# EAGLE board osbo_v11 (EAGLE 7.2.0)
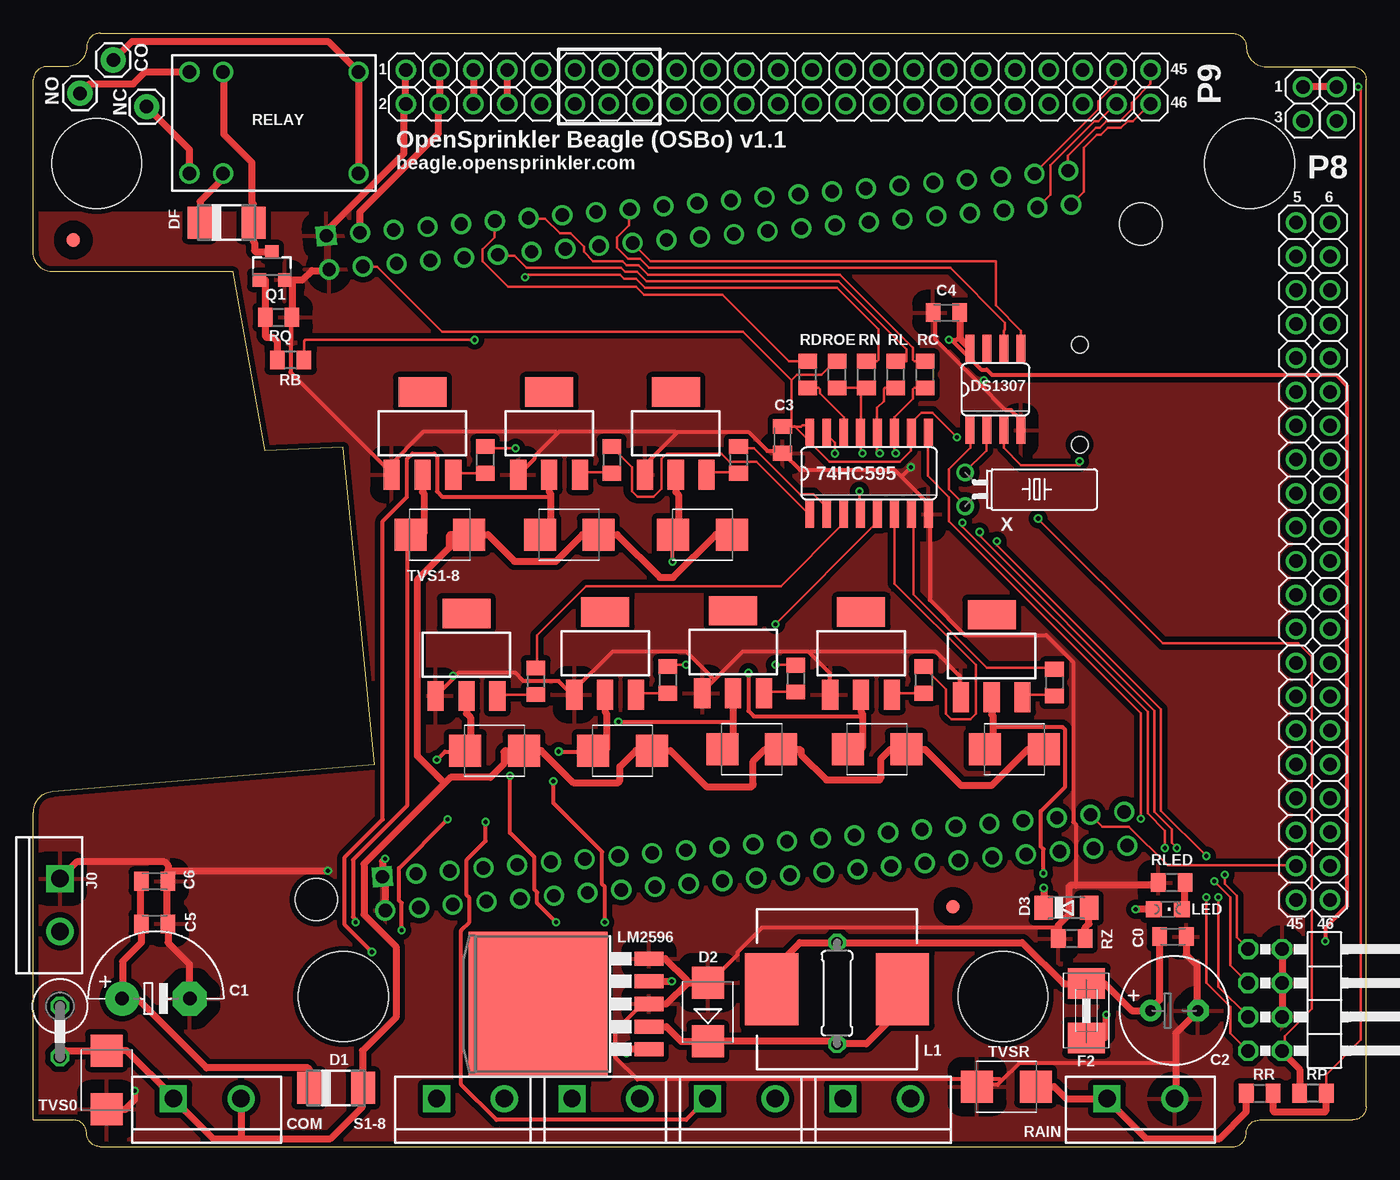
[diagram p1: board, top side]
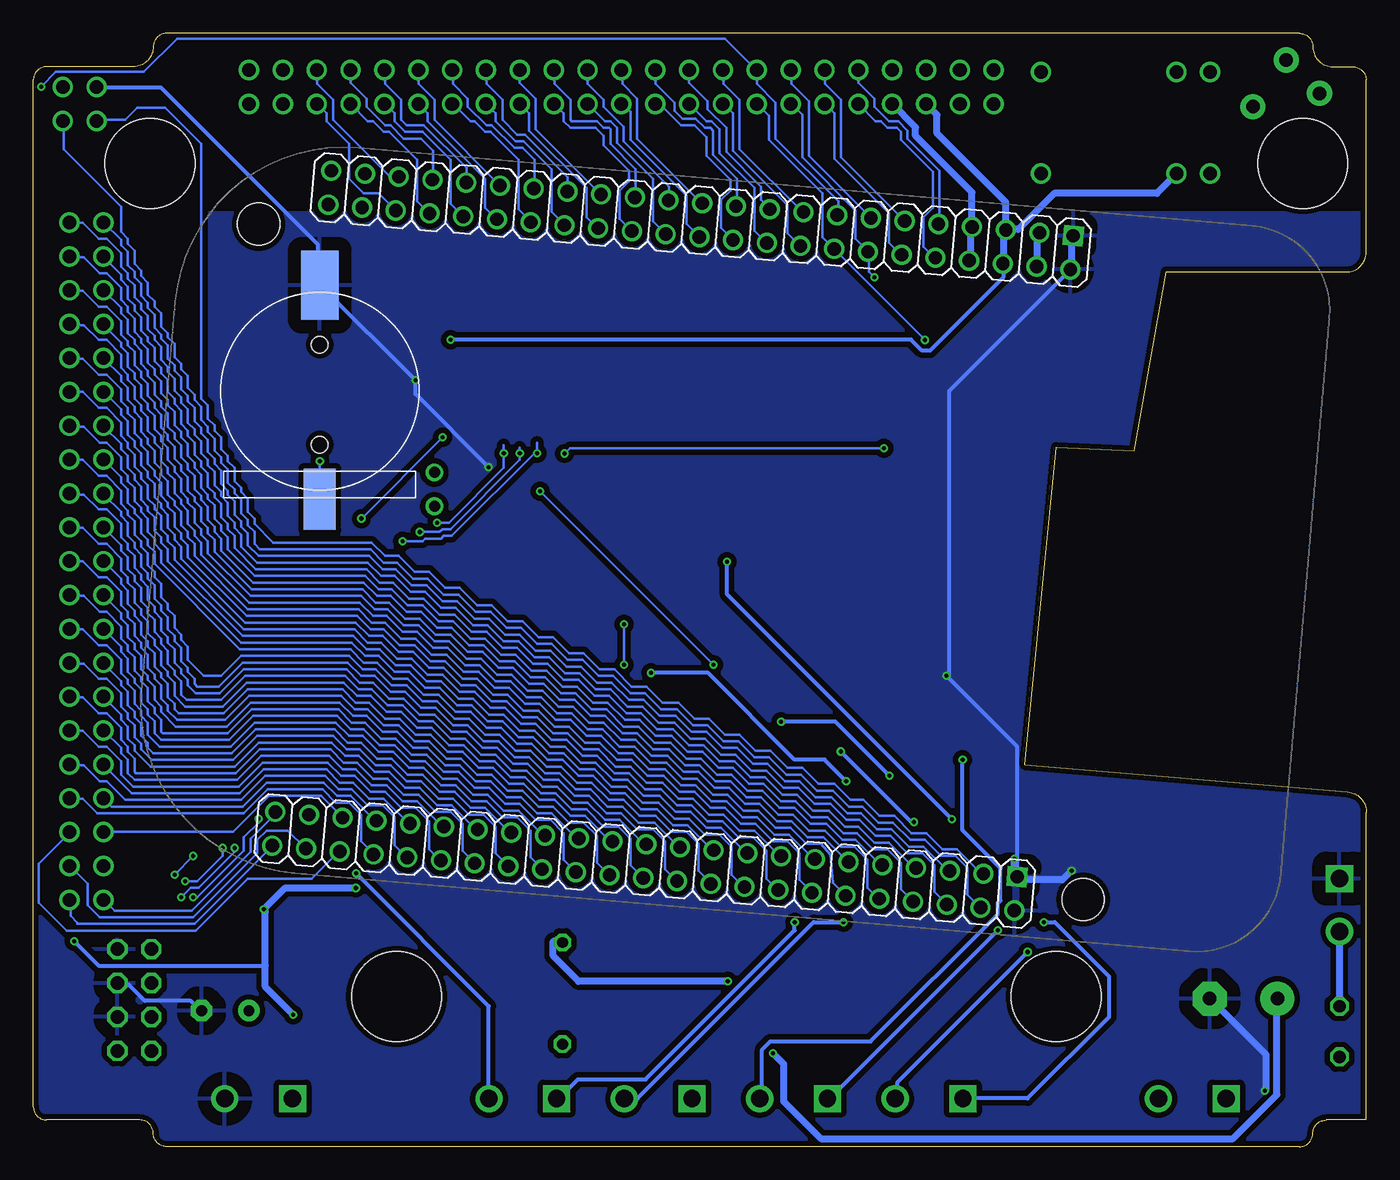
[diagram p2: board, bottom side, seen from below]

Size 100 x 83.5 mm. Coordinates in mm from the lower left corner, seen from the top.
Outline: 5,0 90,0 arc90 91,1 arc-90 92,2 99,2 arc90 100,3 100,80 arc90 99,81 92.5,81 arc-90 91,82.5 arc90 90,83.5 5,83.5 arc90 4,82.5 arc-90 2.5,81 1,81 arc90 0,80 0,67.05 arc90 1.5,65.6 15,65.6 17.4,52.2 23.25,52.45 25.6,28.65 1.4,26.6 arc90 0,25.05 0,2 3,2 arc-90 4,1 arc90 5,0
Copper layers (1*16): Top 0.035mm / dielectric 1.5mm / Bottom 0.035mm
Design rules "Fusion_eagle_rule_v1.1 *": minimum track width 6mil, minimum drill 12mil, track to track 6mil, track to pad 6mil, pad to pad 6mil, via to via 6mil, smd to smd 0mil, copper to edge 10mil, drill to drill 10mil, minimum pad ring 10mil, minimum via ring 6mil, stop-mask expansion 2mil, vias tented up to drill 100mil, thermal gap 40mil
Net classes: 0 default: width 0.203 mm, clearance 0.203 mm; 1 power: width 0.305 mm, clearance 0.254 mm; 2 relay power: width 0.406 mm, clearance 0.254 mm
Holes 6.75 mm at 4.76,73.74 91.24,73.74 23.26,11.26 72.74,11.26

## Footprints (pad centres in the part's own frame; a part is rotated, then mirrored left to right if it is on the bottom)
SO16 = smd 0.66 x 2.032: 1 -4.445,-3.073; 2 -3.175,-3.073; 3 -1.905,-3.073; 4 -0.635,-3.073; 5 0.635,-3.073; 6 1.905,-3.073; 7 3.175,-3.073; 8 4.445,-3.073; 9 4.445,3.073; 10 3.175,3.073; 11 1.905,3.073; 12 0.635,3.073; 13 -0.635,3.073; 14 -1.905,3.073; 15 -3.175,3.073; 16 -4.445,3.073
BATTCON_12MM_SMT = smd 2.8 x 5.2: P$1 0,11.96 | smd 2.4 x 4.6: P$2 0,-4.1 | hole 1.25: 0,7.5; 0,0
C0805K = smd 1.1 x 1.4: 1 -1,0; 2 1,0
E5-10.5-1 = drill 1.016 pad 2.54: + -2.54,0 | drill 1.016 pad 2.54 octagon: - 2.54,0
E3,5-8 = drill 0.813 pad 1.6: + -1.778,0 | drill 0.813 pad 1.6 octagon: - 1.778,0
SCREWTERMINAL-5MM-2-X = drill 1.3 pad 2.032 square: 1 0,0 | drill 1.3 pad 2.032: 2 5.08,0
DO-214AC = smd 1.8 x 2.4: A 2.025,0; C -2.025,0
SMB = smd 2.4 x 2.4: A 2.2,0; C -2.2,0
MINIMELF = smd 1.4 x 1.8: A 1.7,0; C -1.7,0
SO08 = smd 0.66 x 2.032: 1 -1.905,-3.073; 2 -0.635,-3.073; 3 0.635,-3.073; 4 1.905,-3.073; 5 1.905,3.073; 6 0.635,3.073; 7 -0.635,3.073; 8 -1.905,3.073
2X04/90 = drill 1.016 octagon: 1 -3.81,-6.35; 2 -3.81,-3.81; 3 -1.27,-6.35; 4 -1.27,-3.81; 5 1.27,-6.35; 6 1.27,-3.81; 7 3.81,-6.35; 8 3.81,-3.81
0411V = drill 0.914 octagon: 1 -2.54,0; 2 1.27,0
1812 = smd 2.286 x 2.794: 1 -2.046,0; 2 2.046,0
SCREWTERMINAL-4MM-2-X = drill 1.3 pad 2.032 square: 1 0,0 | drill 1.3 pad 2.032: 2 3.96,0
1X01 = drill 1.016 pad 1.88: 1 0,0
CDRH125 = smd 5.4 x 4: 1 0,4.9; 2 0,-4.9
0207/7 = drill 0.813 octagon: 1 -3.81,0; 2 3.81,0
CHIPLED_0805 = smd 1.2 x 1.2: A 0,-1.05; C 0,1.05
TO263-5 = smd 1.067 x 2.159: 1 -3.404,-5.791; 2 -1.702,-5.791; 3 0,-5.791; 4 1.702,-5.791; 5 3.404,-5.791 | smd 10.8 x 10.41: 6 0,2.54
1X02 = drill 1.016: 1 -1.27,0; 2 1.27,0
1X21 = drill 1.016: 1 -25.4,0; 2 -22.86,0; 3 -20.32,0; 4 -17.78,0; 5 -15.24,0; 6 -12.7,0; 7 -10.16,0; 8 -7.62,0; 9 -5.08,0; 10 -2.54,0; 11 0,0; 12 2.54,0; 13 5.08,0; 14 7.62,0; 15 10.16,0; 16 12.7,0; 17 15.24,0; 18 17.78,0; 19 20.32,0; 20 22.86,0; 21 25.4,0
1X23 = drill 1.016: 1 -27.94,0; 2 -25.4,0; 3 -22.86,0; 4 -20.32,0; 5 -17.78,0; 6 -15.24,0; 7 -12.7,0; 8 -10.16,0; 9 -7.62,0; 10 -5.08,0; 11 -2.54,0; 12 0,0; 13 2.54,0; 14 5.08,0; 15 7.62,0; 16 10.16,0; 17 12.7,0; 18 15.24,0; 19 17.78,0; 20 20.32,0; 21 22.86,0; 22 25.4,0; 23 27.94,0
SOT23-3 = smd 1 x 1: 1 -0.95,-1; 2 0.95,-1; 3 0,1.1
R0805 = smd 1.1 x 1.4: 1 -1,0; 2 1,0
RELAY-HK4100F = drill 1.016: 1 12.7,7.62; 2 10.16,7.62; 5 0,7.62; 6 0,0; 9 10.16,0; 10 12.7,0
SOT223 = smd 1.219 x 2.235: 1 -2.311,-3.099; 2 0,-3.099; 3 2.311,-3.099 | smd 3.6 x 2.2: 4 0,3.099
FIDUCIAL_1MM = smd 1 x 1: 1 0,0
BEAGLEBONE_SHIELD = drill 1 square: 1 19.685,50.165; 47 19.685,1.905 | drill 1: 2 19.685,52.705; 3 22.225,50.165; 4 22.225,52.705; 5 24.765,50.165; 6 24.765,52.705; 7 27.305,50.165; 8 27.305,52.705; 9 29.845,50.165; 10 29.845,52.705; 11 32.385,50.165; 12 32.385,52.705; 13 34.925,50.165; 14 34.925,52.705; 15 37.465,50.165; 16 37.465,52.705; 17 40.005,50.165; 18 40.005,52.705; 19 42.545,50.165; 20 42.545,52.705; 21 45.085,50.165; 22 45.085,52.705; 23 47.625,50.165; 24 47.625,52.705; 25 50.165,50.165; 26 50.165,52.705; 27 52.705,50.165; 28 52.705,52.705; 29 55.245,50.165; 30 55.245,52.705; 31 57.785,50.165; 32 57.785,52.705; 33 60.325,50.165; 34 60.325,52.705; 35 62.865,50.165; 36 62.865,52.705; 37 65.405,50.165; 38 65.405,52.705; 39 67.945,50.165; 40 67.945,52.705; 41 70.485,50.165; 42 70.485,52.705; 43 73.025,50.165; 44 73.025,52.705; 45 75.565,50.165; 46 75.565,52.705; 48 19.685,4.445; 49 22.225,1.905; 50 22.225,4.445; 51 24.765,1.905; 52 24.765,4.445; 53 27.305,1.905; 54 27.305,4.445; 55 29.845,1.905; 56 29.845,4.445; 57 32.385,1.905; 58 32.385,4.445; 59 34.925,1.905; 60 34.925,4.445; 61 37.465,1.905; 62 37.465,4.445; 63 40.005,1.905; 64 40.005,4.445; 65 42.545,1.905; 66 42.545,4.445; 67 45.085,1.905; 68 45.085,4.445; 69 47.625,1.905; 70 47.625,4.445; 71 50.165,1.905; 72 50.165,4.445; 73 52.705,1.905; 74 52.705,4.445; 75 55.245,1.905; 76 55.245,4.445; 77 57.785,1.905; 78 57.785,4.445; 79 60.325,1.905; 80 60.325,4.445; 81 62.865,1.905; 82 62.865,4.445; 83 65.405,1.905; 84 65.405,4.445; 85 67.945,1.905; 86 67.945,4.445; 87 70.485,1.905; 88 70.485,4.445; 89 73.025,1.905; 90 73.025,4.445; 91 75.565,1.905; 92 75.565,4.445 | hole 3.175: 14.605,51.435; 80.645,6.35
TC38H = drill 0.813: 1 -1.27,0; 2 1.27,0

## Placement (x,y rotation side)
74HC595  74HC595N  [SO16]  62.7,50.5 0 top
BAT  [BATTCON_12MM_SMT]  78.5,52.65 0 bottom
C0  0.1u  [C0805K]  85.5,15.75 0 top
C1  220uF/63V  [E5-10.5-1]  9.2,11.1 0 top
C2  100u  [E3,5-8]  85.6,10.2 0 top
C3  0.1u  [C0805K]  56.2,53 270 top
C4  0.1u  [C0805K]  68.5,62.55 180 top
C5  0.01u  [C0805K]  9.1,16.7 0 top
C6  0.1u  [C0805K]  9.1,19.9 0 top
COM  [SCREWTERMINAL-5MM-2-X]  10.5,3.6 0 top
D1  S1B  [DO-214AC]  22.7,4.4 0 top
D2  SS24  [SMB]  50.6,10.1 90 top
D3  5.6V  [MINIMELF]  77.5,17.9 0 top
DF  S1B  [DO-214AC]  14.5,69.3 0 top
DS1307  DS1307  [SO08]  72.18,56.8 0 top
EXTOUT1  [2X04/90]  97.5,11 270 top
F1  2A  [0411V]  2,8 270 top
F2  [1812]  79,10.2 270 top
J0  24VAC IN  [SCREWTERMINAL-4MM-2-X]  2,20.1 270 top
JCO  M01PTH  [1X01]  6,81.5 0 top
JNC  M01PTH  [1X01]  8.5,78 180 top
JNO  M01PTH  [1X01]  3.5,79 0 top
L1  150uH  [CDRH125]  60.3,11.8 270 top
L1'  150uH  [0207/7]  60.3,11.5 90 top
LED  [CHIPLED_0805]  85.1,17.8 270 top
LM2596  LM2596-5.0  [TO263-5]  40.4,10.7 90 top
P8-11  [1X02]  95.25,78.2 270 top
P8-12  PINHD-1X21  [1X21]  94.74,43.91 270 top
P8-21  [1X02]  97.79,78.2 270 top
P8-22  PINHD-1X21  [1X21]  97.28,43.91 270 top
P9-1  PINHD-1X23  [1X23]  55.88,80.74 0 top
P9-2  PINHD-1X23  [1X23]  55.88,78.2 0 top
Q1  2N7002  [SOT23-3]  17.9,66 0 top
R1  220  [R0805]  33.9,51.5 270 top
R2  220  [R0805]  43.4,51.5 270 top
R3  220\  [R0805]  52.9,51.5 270 top
R4  220  [R0805]  37.7,34.9 270 top
R5  220  [R0805]  47.6,35 270 top
R6  220  [R0805]  57.2,35.1 270 top
R7  220  [R0805]  66.8,35 270 top
R8  220  [R0805]  76.6,34.8 270 top
RAIN  [SCREWTERMINAL-5MM-2-X]  80.55,3.6 0 top
RB  1.5K  [R0805]  19.3,59 180 top
RC  47  [R0805]  66.9,57.9 90 top
RD  47  [R0805]  58.1,57.9 90 top
RELAY  HK4100-5V  [RELAY-HK4100F]  24.4,80.6 180 top
RL  47  [R0805]  64.7,57.9 90 top
RLED  1K  [R0805]  85.4,19.8 180 top
RN  47  [R0805]  62.5,57.9 90 top
ROE  10K  [R0805]  60.3,57.9 90 top
RP  30K  [R0805]  96,4 180 top
RQ  100K  [R0805]  18.4,62.2 0 top
RR  4.7K  [R0805]  92,4 0 top
RZ  10  [R0805]  77.9,15.6 180 top
S12  [SCREWTERMINAL-5MM-2-X]  30.26,3.6 0 top
S34  [SCREWTERMINAL-5MM-2-X]  40.42,3.6 0 top
S56  [SCREWTERMINAL-5MM-2-X]  50.58,3.6 0 top
S78  [SCREWTERMINAL-5MM-2-X]  60.74,3.6 0 top
T1  BT1308W  [SOT223]  29.2,53.5 0 top
T2  BT1308W  [SOT223]  38.7,53.5 0 top
T3  BT1308W  [SOT223]  48.2,53.5 0 top
T4  BT1308W  [SOT223]  32.5,36.9 0 top
T5  BT1308W  [SOT223]  42.9,37 0 top
T6  BT1308W  [SOT223]  52.5,37.1 0 top
T7  BT1308W  [SOT223]  62.1,37 0 top
T8  BT1308W  [SOT223]  71.9,36.8 0 top
TVS0  SMBJ48CA  [SMB]  5.5,5 270 top
TVS1  SMBJ48CA  [SMB]  30.5,45.9 180 top
TVS2  TVSSMB  [SMB]  40.2,45.9 180 top
TVS3  TVSSMB  [SMB]  50.2,45.9 180 top
TVS4  TVSSMB  [SMB]  34.6,29.7 180 top
TVS5  TVSSMB  [SMB]  44.2,29.7 180 top
TVS6  TVSSMB  [SMB]  53.9,29.8 180 top
TVS7  TVSSMB  [SMB]  63.3,29.8 180 top
TVS8  TVSSMB  [SMB]  73.6,29.8 180 top
TVSR  TVSSMB  [SMB]  73,4.5 180 top
U$1  FIDUCIAL  [FIDUCIAL_1MM]  3,68 0 top
U$2  BEAGLEBONE_OUTLINE  [BEAGLEBONE_SHIELD]  2.2,68.5 175 bottom
U$3  FIDUCIAL  [FIDUCIAL_1MM]  69,18 0 top
X  32.768kHz  [TC38H]  69.9,49.3 270 top

## Tracks (layer width: path | path; a pad name or v marks a point on that pad's centre or on a via)
24VAC
  Top 0.508: F1.2 2,6.8 2.4,7.2 TVS0.C 7,7.2 10.4,3.8 COM.1 13.5,0.6 15.6,0.6 | 15.6,0.6 22.3,0.6 24.7,3 24.7,4.4 D1.A 24.7,4.6 24.7,7.2 27.2,9.7 27.2,15 24.8,17.4 24.8,21.2 30.85,27.25 | 15.6,0.6 15.6,3.6 COM.2 | TVS8.C 74.6,29.8 71.9,27.1 69.6,27.1 66.9,29.8 TVS7.C 64.3,29.8 63.6,29.1 63.6,27.7 63.5,27.5 59.5,27.5 57.6,29.4 57.6,29.7 57.5,29.8 TVS6.C 54.9,29.8 54,28.9 54,27.2 53.9,27 50.5,27 47.8,29.7 TVS5.C 45.2,29.7 44,28.5 44,27.5 43.9,27.3 40.5,27.3 38.1,29.7 TVS4.C 35.4,29.7 35.3,29.6 35.3,28.7 34.3,27.7 31.3,27.7 30.85,27.25 | TVS3.C 51.2,45.9 48,42.7 47,42.7 43.8,45.9 TVS2.C 41.2,45.9 39.2,43.9 36.1,43.9 34.1,45.9 TVS1.C 31.3,45.9 31.2,45.8 31.2,44.9 28.8,42.5 28.8,29.3 30.85,27.25
  Bottom 0.508: 2,6.7 F1.2
A1  (via drill 0.3)
  Top 0.203: v36.9,65.2 37.1,65.4 44,65.4 44.3,65.1 45.2,65.1 45.9,64.4 60.3,64.4 63.4,61.3 63.4,59 63.3,58.9 RN.2
  Bottom 0.203: P9-2.7 43.1,78.2 42.3,77.4 42.3,74.2 38.3,70.2 38.3,68.1 37.4,67.2 U$2.60 37.3,67.1 37.3,65.6 v36.9,65.2
ACIN
  Bottom 0.508: J0.2 F1.1
CO
  Top 0.508: JCO.1 7.4,82.9 22.1,82.9 RELAY.6 RELAY.5
D5
  Top 0.203: RD.2 56.7,58.9 51.7,63.9 45.8,63.9 45.2,64.5 35.6,64.5 33.7,66.4 33.7,67.3 34.6,68.2 34.6,69.4 U$2.57
  Bottom 0.203: P9-1.6 40.6,80.7 40.6,79.7 39.4,78.5 39.4,74.2 34.7,69.5 U$2.57
D6
  Top 0.203: RC.2 66.1,58.9 66,59 66,59.9 60.5,65.4 46.1,65.4 45.4,66.1 44.5,66.1 44.2,66.4 42,66.4 41.3,67.1 41.3,67.5 40.3,68.5 39.5,68.5 38.4,69.6 37.2,69.6 U$2.59
  Bottom 0.203: P9-1.7 43.1,80.7 43.1,79.7 41.8,78.4 41.8,74.3 37.2,69.7 U$2.59
D7
  Top 0.203: RL.2 65.5,58.9 65.5,59.8 60.4,64.9 46,64.9 45.3,65.6 44.4,65.6 44.1,65.9 37,65.9 36.1,66.8 34.9,66.8 U$2.58
  Bottom 0.203: P9-2.6 40.6,78.2 39.9,77.5 39.9,74.1 35.8,70 35.8,67.8 34.9,66.9 U$2.58
GND  (via drill 0.3)
  Top 0.305: 58.22,37.05 58.12,37.15 53.24,37.15 51.11,35.02 | 58.22,37.05 59.74,35.53 59.74,33.9 T7.1 | 51.11,35.02 50.19,34.11 T6.1 | T8.1 69.49,33.9 69.49,35.33 67.67,37.15 58.32,37.15 58.22,37.05 | 31.6,35.22 31.9,35.53 36.17,35.53 36.78,34.92 39.42,34.92 40.44,33.9 T5.1 40.44,34.11 43.49,37.15 48.97,37.15 51.11,35.02 | 31.6,35.22 30.28,33.9 T4.1 | v31.5,35.33 31.6,35.22 | D2.A 50.8,12.36 52.83,14.39 52.83,14.6 54.66,16.43 76.81,16.43 76.9,16.6 | 72.64,4.95 73.97,6.27 85.7,6.27 | 72.64,4.95 72.34,4.64 70.92,4.64 TVSR.A | LM2596.3 46.13,10.53 45.52,10.53 43.69,8.71 43.69,6.67 45.31,5.05 72.54,5.05 72.64,4.95 | 71.02,57.17 72.95,55.24 73.36,55.24 73.97,54.63 73.97,53.82 DS1307.4 | 71.02,57.17 67.67,60.52 67.67,62.35 C4.2 | v71.32,57.47 71.02,57.17 | RQ.2 19.3,62.15 19.3,58.08 26.82,50.56 T1.1 26.62,50.97 29.26,53.61 39.22,53.61 39.32,53.51 | 48.26,53.51 45.92,51.17 45.92,50.56 T3.1 | 48.26,53.51 48.36,53.61 53.65,53.61 55.07,52.19 56.08,52.19 C3.2 56.29,51.99 57.51,50.77 64.62,50.77 65.13,50.26 | 65.13,50.26 67.06,48.33 67.06,47.52 74HC595.8 67.26,47.31 67.26,41.01 69.9,38.37 76,38.37 78.03,36.34 78.03,24.35 78.23,24.15 78.23,19.6 | 39.32,53.51 39.42,53.61 48.16,53.61 48.26,53.51 | 39.32,53.51 37.59,51.78 37.59,51.58 36.58,50.56 T2.1 | 65.13,50.26 v65.84,50.97
  Top 0.508: 19.4,65 RQ.2 | Q1.2 19.4,65 | 19.4,65 20.2,65 20.9,65.7 22.1,65.7 U$2.48 | P9-1.1 P9-2.1 27.8,78 27.8,74.5 22,68.7 22,68.4 U$2.47 | 49.1,12.3 D2.A | 49.1,12.3 47.5,10.7 LM2596.3 | 49.1,12.3 49,12.5 47.4,14.1 LM2596.5 | C0.2 86.5,14.4 87.3,13.6 87.3,10.2 C2.- 87.2,10 85.7,8.5 85.7,6.27 85.7,3.6 RAIN.2 | RZ.2 76.9,16.6 77.7,17.4 77.7,19.5 77.8,19.6 78.23,19.6 84.4,19.6 RLED.2 | U$2.2 26.4,17.8 26.4,20 26.2,20.2 U$2.1 26.2,20.5 26.2,21.4 v26.4,21.6 | P8-11.1 95.3,79.5 97.7,79.5 P8-21.1 | EXTOUT1.2 93.7,12.3 EXTOUT1.4 93.7,12 93.7,9.8 EXTOUT1.6 | C1.- 11.7,11.1 11.7,13.7 10.1,15.3 C5.2 10,17 10,20 C6.2 10.1,20.7 | 10.1,20.7 10.1,21.1 9.8,21.4 3.3,21.4 J0.1 | 10.1,20.7 v22.1,20.7 | v7.6,4.2 7.6,3.5 6.9,2.8 TVS0.A
  Bottom 0.305: U$2.1 26.21,20.29 26.21,30.04 v31.5,35.33 31.29,35.33 31.29,56.66 22.35,65.6 U$2.48 | EXTOUT1.4 93.68,12.16 92.86,12.16 91.64,10.94 88.19,10.94 87.58,10.33 C2.- | P8-11.1 95.1,79.42 90.42,79.42 78.64,67.63 78.64,64.79 BAT.P$1 78.44,64.59 v71.32,57.47 71.32,56.46 v65.84,50.97
  Bottom 0.508: U$2.48 22.1,65.8 22.1,68.2 22,68.3 U$2.47 | v26.4,21.6 26.4,20.2 26.2,20 22.8,20 v22.1,20.7 | v7.6,4.2 7.5,4.3 7.5,6.9 11.7,11.1 C1.-
  pour Top (isolate 0.406): 0,70 100,70 100,0 0,0
  pour Bottom (isolate 0.406): 0,70 100,70 100,0 0,0
N$1
  Top 0.508: RLED.1 86.4,17.8 LED.C
N$2  (via drill 0.3)
  Top 0.508: C6.1 8,20 8,17 C5.1 8.1,15.3 6.7,13.9 6.7,11.1 C1.+ 6.9,11 7.9,11 13,5.9 20.6,5.9 20.7,5.8 20.7,4.4 D1.C | v44.5,7 44.8,7.3 46.1,7.3 LM2596.1
  Bottom 0.508: v44.5,7 43.7,6.2 43.7,3.4 40.9,0.6 10,0.6 6.7,3.9 6.7,11.1 C1.+
N$3
  Top 0.203: R1.2 31.6,50.5 T1.3
N$4  (via drill 0.3)
  Top 0.203: v55.68,36.14 57.1,36.14 R6.1 | v55.68,39.19 63.2,46.7 63.2,47.31 74HC595.5
  Bottom 0.203: v55.68,39.19 v55.68,36.14
N$5
  Top 0.203: R7.1 66.85,35.93 68.48,34.31 68.48,32.48 68.89,32.07 70.31,32.07 70.71,32.48 70.71,36.14 64.62,42.23 64.62,47.31 74HC595.6
N$6
  Top 0.508: D3.A 79.2,16.7 78.9,16.4 RZ.1
N$7
  Top 0.203: R8.1 76.4,35.93 71.53,35.93 66.04,41.42 66.04,47.31 74HC595.7
N$8
  Top 0.508: LM2596.2 47.5,9 48.6,7.9 D2.C 60.2,7.9 L1'.1 62.5,7.7 65.2,10.4 L1.1
N$9
  Top 0.203: DS1307.1 70.3,53.7 70.3,52.4 68.7,50.8 68.7,49.3 69.9,48.1 X.2
N$10  (via drill 0.3)
  Top 0.203: v48.97,36.14 47.75,36.14 R5.1 | v61.98,49.14 61.98,47.52 74HC595.4
  Bottom 0.203: v61.98,49.14 v48.97,36.14
N$11
  Top 0.203: R4.1 37.8,35.93 37.8,38.37 41.45,42.03 56.08,42.03 60.76,46.7 60.76,47.31 74HC595.3
N$12
  Top 0.203: R3.1 53.04,52.39 54.05,52.39 57.51,48.94 58.52,48.94 59.33,48.13 59.33,47.52 74HC595.2
N$13
  Top 0.203: R2.1 43.49,52.39 44.91,50.97 44.91,49.14 45.31,48.74 46.53,48.74 47.14,49.35 47.14,51.58 47.55,51.99 51.61,51.99 52.22,51.38 54.25,51.38 58.12,47.52 74HC595.1
N$14  (via drill 0.3)
  Top 0.203: v36.17,52.39 33.93,52.39 R1.1 | v60.15,51.99 60.15,52.8 59.54,53.41 74HC595.15
  Bottom 0.203: v36.17,52.39 59.74,52.39 v60.15,51.99
N$15
  Top 0.203: R2.2 43.28,50.56 41.05,50.56 T2.3
N$16  (via drill 0.3)
  Top 0.305: v24.18,16.83 24.18,17.04 23.98,17.24 23.98,21.51 28.04,25.57 28.04,45.48 28.25,45.69 TVS1.A
  Top 0.508: TVS1.A 29.2,45.9 29.3,46 29.3,49 29.2,49.1 T1.2
  Bottom 0.305: v24.18,16.83 23.37,16.83 19.3,12.77 19.3,9.72 25.4,3.63 30.07,3.63 S12.1
N$17  (via drill 0.3)
  Top 0.305: 38.8,48.74 30.68,48.74 30.28,49.14 30.28,51.78 30.07,51.99 28.45,51.99 28.04,51.58 28.04,48.74 26.21,46.91 26.21,24.55 23.37,21.71 23.37,16.63 v25.4,14.6
  Top 0.508: TVS2.A 38.8,45.9 38.8,48.74 38.8,49 38.7,49.1 T2.2
  Bottom 0.305: v25.4,14.6 35.15,4.85 35.15,3.63 S12.2
N$18  (via drill 0.3)
  Top 0.305: v47.96,43.86 47.96,45.69 TVS3.A | v31.09,24.55 27.43,20.9 27.43,18.46 27.64,18.26 v27.64,16.22
  Top 0.508: TVS3.A 48.4,45.9 48.4,48.9 48.2,49.1 T3.2
  Bottom 0.305: v47.96,43.86 47.96,41.42 v31.09,24.55 | v27.64,16.22 40.23,3.63 S34.1
N$19
  Top 0.203: R3.2 52.83,50.56 50.6,50.56 T3.3
N$20  (via drill 0.3)
  Top 0.305: v30.28,29.03 30.89,29.64 32.31,29.64 TVS4.A
  Top 0.508: TVS4.A 32.8,29.7 32.8,32.2 32.5,32.5 T4.2
  Bottom 0.305: v30.28,29.03 30.28,23.74 27.43,20.9 27.43,18.46 27.64,18.26 27.64,17.44 37.19,7.89 44.7,7.89 45.31,7.28 45.31,3.63 S34.2
N$21
  Top 0.203: R4.2 34.9,33.9 T4.3
N$22  (via drill 0.3)
  Top 0.305: v39.42,29.64 41.86,29.64 TVS5.A | v33.93,24.35 33.93,22.93 32.51,21.51 32.51,18.87 32.72,18.66 32.72,16.83 32.11,16.22 32.11,4.64 34.75,2 48.97,2 50.39,3.42 S56.1
  Top 0.508: TVS5.A 42.9,29.7 43,29.8 43,32.5 42.9,32.6 T5.2
  Bottom 0.305: v39.42,29.64 34.14,24.35 v33.93,24.35
N$23  (via drill 0.3)
  Top 0.305: v43.89,31.87 52.5,31.87 | v35.76,27.81 35.76,23.54 37.59,21.71 37.59,19.27 37.8,19.07 37.8,18.26 v39.22,16.83
  Top 0.508: TVS6.A 52.5,29.8 52.5,31.87 T6.2
  Bottom 0.305: v43.89,31.87 39.83,31.87 v35.76,27.81 | v39.22,16.83 41.45,16.83 54.66,3.63 55.47,3.63 S56.2
N$24  (via drill 0.3)
  Top 0.305: 62.2,32.28 54.05,32.28 53.65,32.68 v53.65,35.53 | v39.01,27.4 39.01,25.77 42.67,22.12 42.67,19.68 42.88,19.48 v42.88,16.83
  Top 0.508: TVS7.A 62.1,29.8 62.2,29.9 62.2,32.28 62.2,32.5 62.1,32.6 T7.2
  Bottom 0.305: v53.65,35.53 49.38,35.53 42.88,29.03 40.64,29.03 v39.01,27.4 | v42.88,16.83 42.88,16.22 54.05,5.05 59.13,5.05 60.55,3.63 S78.1
N$25  (via drill 0.3)
  Top 0.305: 72,31.46 77.22,31.46 77.42,31.26 77.42,26.99 75.59,25.16 75.59,22.52 75.79,22.32 v75.79,20.49
  Top 0.508: TVS8.A 72,29.8 72,31.46 72,32.3 71.9,32.4 T8.2
  Bottom 0.305: v75.79,20.49 65.84,10.53 65.84,3.63 S78.2
N$26
  Top 0.203: R5.2 45.3,34 T5.3
N$27
  Top 0.203: R6.2 54.9,34.1 T6.3
N$28
  Top 0.203: R7.2 64.5,34 T7.3
N$29
  Top 0.203: R8.2 76.4,33.9 74.37,33.9 T8.3
N$30
  Top 0.203: DS1307.2 71.5,53.7 71.5,52.2 69.9,50.6 X.1
N$31
  Top 0.508: TVSR.C 76.6,4.5 77.5,3.6 RAIN.1 80.7,3.4 83.5,0.6 89,0.6 91,2.6 RR.1
N$32
  Top 0.508: Q1.1 17.4,65 RQ.1 17.4,60.8 17.5,60.7 18,60.7 18.3,60.4 RB.2
N$34
  Bottom 0.203: U$2.3 28.8,20.4 30.7,22.3 31.8,22.3 33,23.5 34.1,23.5 35.4,24.8 36.5,24.8 37.7,26 38.7,26 39.9,27.2 41.1,27.2 42.3,28.4 43.4,28.4 44.7,29.7 45.8,29.7 47,30.9 48.1,30.9 49.3,32.1 50.4,32.1 51.6,33.3 52.8,33.3 54,34.5 55.1,34.5 56.4,35.8 57.5,35.8 58.7,37 59.8,37 61,38.2 62.1,38.2 63.3,39.4 64.4,39.4 65.6,40.6 66.7,40.6 68,41.9 69.1,41.9 70.3,43.1 71.4,43.1 72.6,44.3 73.6,44.3 74.6,45.3 82,45.3 83.4,46.7 83.4,47.1 83.9,47.6 83.9,48.6 84.4,49.1 84.4,49.4 84.9,49.9 84.9,50.9 85.4,51.4 85.4,51.8 85.9,52.3 85.9,53.2 86.4,53.7 86.4,54.1 86.9,54.6 86.9,55.6 87.4,56.1 87.4,75.2 90.1,77.9 92.2,77.9 93.1,77 95.2,77 P8-11.2
N$35
  Bottom 0.203: P8-12.1 94.7,69.3 93.4,68 93.4,67.6 92.9,67.1 92.9,66.1 92.4,65.6 92.4,65.2 91.9,64.7 91.9,63.8 91.4,63.3 91.4,62.9 90.9,62.4 90.9,61.4 90.4,60.9 90.4,60.6 89.9,60.1 89.9,59.1 89.4,58.6 89.4,58.2 88.9,57.7 88.9,56.8 88.4,56.3 88.4,55.9 87.9,55.4 87.9,54.4 87.4,53.9 87.4,53.5 86.9,53 86.9,52.1 86.4,51.6 86.4,51.2 85.9,50.7 85.9,49.7 85.4,49.2 85.4,48.9 84.9,48.4 84.9,47.4 84.4,46.9 84.4,46.5 83.9,46 83.9,45.1 83.1,44.3 74.8,44.3 73.8,43.3 72.8,43.3 71.6,42.1 70.5,42.1 69.3,40.9 68.2,40.9 66.9,39.6 65.8,39.6 64.6,38.4 63.5,38.4 62.3,37.2 61.2,37.2 60,36 58.9,36 57.7,34.8 56.6,34.8 55.3,33.5 54.2,33.5 53,32.3 51.8,32.3 50.6,31.1 49.5,31.1 48.3,29.9 47.2,29.9 46,28.7 44.9,28.7 43.6,27.4 42.5,27.4 41.3,26.2 40.1,26.2 38.9,25 37.9,25 36.7,23.8 35.6,23.8 34.3,22.5 33.2,22.5 31.3,20.6 U$2.5
N$36  (via drill 0.3)
  Top 0.203: DS1307.3 72.8,53.7 72.8,52.4 74.1,51.1 78.5,51.1 v78.5,51.4
  Bottom 0.203: v78.5,51.4 BAT.P$2
N$37
  Bottom 0.203: P8-12.2 94.7,66.7 93.4,65.4 93.4,65 92.9,64.5 92.9,63.6 92.4,63.1 92.4,62.7 91.9,62.2 91.9,61.2 91.4,60.7 91.4,60.4 90.9,59.9 90.9,58.9 90.4,58.4 90.4,58 89.9,57.5 89.9,56.6 89.4,56.1 89.4,55.7 88.9,55.2 88.9,54.2 88.4,53.7 88.4,53.3 87.9,52.8 87.9,51.9 87.4,51.4 87.4,51 86.9,50.5 86.9,49.5 86.4,49 86.4,48.7 85.9,48.2 85.9,47.2 85.4,46.7 85.4,46.3 84.9,45.8 84.9,44.9 83.3,43.3 75,43.3 74,42.3 73,42.3 71.8,41.1 70.7,41.1 69.5,39.9 68.4,39.9 67.1,38.6 66,38.6 64.8,37.4 63.7,37.4 62.5,36.2 61.4,36.2 60.2,35 59.1,35 57.9,33.8 56.8,33.8 55.5,32.5 54.4,32.5 53.2,31.3 52,31.3 50.8,30.1 49.7,30.1 48.5,28.9 47.4,28.9 46.2,27.7 45.1,27.7 43.8,26.4 42.7,26.4 41.5,25.2 40.3,25.2 39.1,24 38.1,24 36.9,22.8 35.8,22.8 34,21 33.8,21 U$2.7
N$38
  Bottom 0.203: P8-12.3 94.7,64.2 93.4,62.9 93.4,62.5 92.9,62 92.9,61 92.4,60.5 92.4,60.2 91.9,59.7 91.9,58.7 91.4,58.2 91.4,57.8 90.9,57.3 90.9,56.4 90.4,55.9 90.4,55.5 89.9,55 89.9,54 89.4,53.5 89.4,53.1 88.9,52.6 88.9,51.7 88.4,51.2 88.4,50.8 87.9,50.3 87.9,49.3 87.4,48.8 87.4,48.5 86.9,48 86.9,47 86.4,46.5 86.4,46.1 85.9,45.6 85.9,44.7 83.5,42.3 75.2,42.3 74.2,41.3 73.2,41.3 72,40.1 70.9,40.1 69.7,38.9 68.6,38.9 67.3,37.6 66.2,37.6 65,36.4 63.9,36.4 62.7,35.2 61.6,35.2 60.4,34 59.3,34 58.1,32.8 57,32.8 55.7,31.5 54.6,31.5 53.4,30.3 52.2,30.3 51,29.1 49.9,29.1 48.7,27.9 47.6,27.9 46.4,26.7 45.3,26.7 44,25.4 42.9,25.4 41.7,24.2 40.5,24.2 39.3,23 38.3,23 36.4,21.1 U$2.9
N$39
  Bottom 0.203: P8-12.4 94.7,61.6 93.4,60.3 93.4,60 92.9,59.5 92.9,58.5 92.4,58 92.4,57.6 91.9,57.1 91.9,56.2 91.4,55.7 91.4,55.3 90.9,54.8 90.9,53.8 90.4,53.3 90.4,52.9 89.9,52.4 89.9,51.5 89.4,51 89.4,50.6 88.9,50.1 88.9,49.1 88.4,48.6 88.4,48.3 87.9,47.8 87.9,46.8 87.4,46.3 87.4,45.9 86.9,45.4 86.9,44.5 83.7,41.3 75.4,41.3 74.4,40.3 73.4,40.3 72.2,39.1 71.1,39.1 69.9,37.9 68.8,37.9 67.5,36.6 66.4,36.6 65.2,35.4 64.1,35.4 62.9,34.2 61.8,34.2 60.6,33 59.5,33 58.3,31.8 57.2,31.8 55.9,30.5 54.8,30.5 53.6,29.3 52.4,29.3 51.2,28.1 50.1,28.1 48.9,26.9 47.8,26.9 46.6,25.7 45.5,25.7 44.2,24.4 43.1,24.4 41.9,23.2 40.7,23.2 38.9,21.4 U$2.11
N$40
  Bottom 0.203: P8-12.5 94.7,59.1 93.4,57.8 93.4,57.4 92.9,56.9 92.9,56 92.4,55.5 92.4,55.1 91.9,54.6 91.9,53.6 91.4,53.1 91.4,52.7 90.9,52.2 90.9,51.3 90.4,50.8 90.4,50.4 89.9,49.9 89.9,48.9 89.4,48.4 89.4,48.1 88.9,47.6 88.9,46.6 88.4,46.1 88.4,45.7 87.9,45.2 87.9,44.3 83.9,40.3 75.6,40.3 74.6,39.3 73.6,39.3 72.4,38.1 71.3,38.1 70.1,36.9 69,36.9 67.7,35.6 66.6,35.6 65.4,34.4 64.3,34.4 63.1,33.2 62,33.2 60.8,32 59.7,32 58.5,30.8 57.4,30.8 56.1,29.5 55,29.5 53.8,28.3 52.6,28.3 51.4,27.1 50.3,27.1 49.1,25.9 48,25.9 46.8,24.7 45.7,24.7 44.4,23.4 43.3,23.4 41.4,21.5 U$2.13
N$41
  Bottom 0.203: P8-12.6 94.7,56.6 93.4,55.3 93.4,54.9 92.9,54.4 92.9,53.4 92.4,52.9 92.4,52.5 91.9,52 91.9,51.1 91.4,50.6 91.4,50.2 90.9,49.7 90.9,48.7 90.4,48.2 90.4,47.9 89.9,47.4 89.9,46.4 89.4,45.9 89.4,45.5 88.9,45 88.9,44.1 84.1,39.3 75.8,39.3 74.8,38.3 73.8,38.3 72.6,37.1 71.5,37.1 70.3,35.9 69.2,35.9 67.9,34.6 66.8,34.6 65.6,33.4 64.5,33.4 63.3,32.2 62.2,32.2 61,31 59.9,31 58.7,29.8 57.6,29.8 56.3,28.5 55.2,28.5 54,27.3 52.8,27.3 51.6,26.1 50.5,26.1 49.3,24.9 48.2,24.9 47,23.7 45.9,23.7 43.9,21.7 U$2.15
N$42
  Bottom 0.203: P8-12.7 94.7,54 93.4,52.7 93.4,52.3 92.9,51.8 92.9,50.9 92.4,50.4 92.4,50 91.9,49.5 91.9,48.5 91.4,48 91.4,47.7 90.9,47.2 90.9,46.2 90.4,45.7 90.4,45.3 89.9,44.8 89.9,43.9 84.3,38.3 76,38.3 75,37.3 74,37.3 72.8,36.1 71.7,36.1 70.5,34.9 69.4,34.9 68.1,33.6 67,33.6 65.8,32.4 64.7,32.4 63.5,31.2 62.4,31.2 61.2,30 60.1,30 58.9,28.8 57.8,28.8 56.5,27.5 55.4,27.5 54.2,26.3 53,26.3 51.8,25.1 50.7,25.1 49.5,23.9 48.4,23.9 46.5,22 U$2.17
N$43
  Bottom 0.203: P8-12.8 94.7,51.5 93.4,50.2 93.4,49.8 92.9,49.3 92.9,48.3 92.4,47.8 92.4,47.5 91.9,47 91.9,46 91.4,45.5 91.4,45.1 90.9,44.6 90.9,43.7 84.5,37.3 76.2,37.3 75.2,36.3 74.2,36.3 73,35.1 71.9,35.1 70.7,33.9 69.6,33.9 68.3,32.6 67.2,32.6 66,31.4 64.9,31.4 63.7,30.2 62.6,30.2 61.4,29 60.3,29 59.1,27.8 58,27.8 56.7,26.5 55.6,26.5 54.4,25.3 53.2,25.3 52,24.1 50.9,24.1 49,22.2 U$2.19
N$44
  Bottom 0.203: U$2.21 51.5,22.4 53.4,24.3 54.6,24.3 55.8,25.5 56.9,25.5 58.2,26.8 59.3,26.8 60.5,28 61.6,28 62.8,29.2 63.9,29.2 65.1,30.4 66.2,30.4 67.4,31.6 68.5,31.6 69.8,32.9 70.9,32.9 72.1,34.1 73.2,34.1 74.4,35.3 75.4,35.3 76.4,36.3 84.3,36.3 86.1,34.5 87.7,34.5 87.9,34.7 87.9,35.1 88.4,35.6 88.4,35.9 88.9,36.4 88.9,37.4 89.4,37.9 89.4,38.3 89.9,38.8 89.9,39.7 90.4,40.2 90.4,40.6 90.9,41.1 90.9,42.1 91.4,42.6 91.4,43 91.9,43.5 91.9,44.4 92.4,44.9 92.4,45.3 92.9,45.8 92.9,46.8 93.4,47.3 93.4,47.6 94.7,48.9 P8-12.9
N$45
  Bottom 0.203: U$2.23 54.1,22.6 56,24.5 57.1,24.5 58.4,25.8 59.5,25.8 60.7,27 61.8,27 63,28.2 64.1,28.2 65.3,29.4 66.4,29.4 67.6,30.6 68.7,30.6 70,31.9 71.1,31.9 72.3,33.1 73.4,33.1 74.6,34.3 75.6,34.3 76.6,35.3 84.1,35.3 85.9,33.5 88.5,33.5 88.9,33.9 88.9,34.9 89.4,35.4 89.4,35.7 89.9,36.2 89.9,37.2 90.4,37.7 90.4,38.1 90.9,38.6 90.9,39.5 91.4,40 91.4,40.4 91.9,40.9 91.9,41.9 92.4,42.4 92.4,42.8 92.9,43.3 92.9,44.2 93.4,44.7 93.4,45.1 94.7,46.4 P8-12.10
N$46
  Bottom 0.203: P8-12.11 94.7,43.9 93.4,42.6 93.4,42.2 92.9,41.7 92.9,40.7 92.4,40.2 92.4,39.8 91.9,39.3 91.9,38.4 91.4,37.9 91.4,37.5 90.9,37 90.9,36 90.4,35.5 90.4,35.2 89.9,34.7 89.9,33.7 89.4,33.2 89.4,32.8 89.1,32.5 85.7,32.5 83.9,34.3 76.8,34.3 75.8,33.3 74.8,33.3 73.6,32.1 72.5,32.1 71.3,30.9 70.2,30.9 68.9,29.6 67.8,29.6 66.6,28.4 65.5,28.4 64.3,27.2 63.2,27.2 62,26 60.9,26 59.7,24.8 58.6,24.8 56.6,22.8 U$2.25
N$47
  Bottom 0.203: P8-12.12 94.7,41.3 93.4,40 93.4,39.6 92.9,39.1 92.9,38.2 92.4,37.7 92.4,37.3 91.9,36.8 91.9,35.8 91.4,35.3 91.4,35 90.9,34.5 90.9,33.5 90.4,33 90.4,32.6 89.3,31.5 85.5,31.5 83.7,33.3 77,33.3 76,32.3 75,32.3 73.8,31.1 72.7,31.1 71.5,29.9 70.4,29.9 69.1,28.6 68,28.6 66.8,27.4 65.7,27.4 64.5,26.2 63.4,26.2 62.2,25 61.1,25 59.3,23.2 59.1,23.2 U$2.27
N$48
  Bottom 0.203: P8-12.13 94.7,38.8 93.4,37.5 93.4,37.1 92.9,36.6 92.9,35.6 92.4,35.1 92.4,34.8 91.9,34.3 91.9,33.3 91.4,32.8 91.4,32.4 90.9,31.9 90.9,31 90.4,30.5 85.3,30.5 83.5,32.3 77.2,32.3 76.2,31.3 75.2,31.3 74,30.1 72.9,30.1 71.7,28.9 70.6,28.9 69.3,27.6 68.2,27.6 67,26.4 65.9,26.4 64.7,25.2 63.6,25.2 61.7,23.3 U$2.29
N$49
  Bottom 0.203: P8-12.14 94.7,36.2 93.4,34.9 93.4,34.6 92.9,34.1 92.9,33.1 92.4,32.6 92.4,32.2 91.9,31.7 91.9,30.8 91.4,30.3 91.4,29.9 91,29.5 85.1,29.5 83.3,31.3 77.4,31.3 76.4,30.3 75.4,30.3 74.2,29.1 73.1,29.1 71.9,27.9 70.8,27.9 69.5,26.6 68.4,26.6 67.2,25.4 66.1,25.4 64.2,23.5 U$2.31
N$50
  Bottom 0.203: P8-12.15 94.7,33.7 93.4,32.4 93.4,32 92.9,31.5 92.9,30.6 92.4,30.1 92.4,29.7 91.2,28.5 84.9,28.5 83.1,30.3 77.6,30.3 76.6,29.3 75.6,29.3 74.4,28.1 73.3,28.1 72.1,26.9 71,26.9 69.7,25.6 68.6,25.6 66.7,23.7 U$2.33
N$51
  Bottom 0.203: P8-12.16 94.7,31.2 93.4,29.9 93.4,29.5 92.9,29 92.9,28 92.4,27.5 84.7,27.5 82.9,29.3 77.8,29.3 76.8,28.3 75.8,28.3 74.6,27.1 73.5,27.1 72.3,25.9 71.2,25.9 69.4,24.1 69.2,24.1 U$2.35
N$52
  Bottom 0.203: P8-12.17 94.7,28.6 92.6,26.5 84.5,26.5 82.7,28.3 78,28.3 77,27.3 76,27.3 74.8,26.1 73.7,26.1 71.8,24.2 U$2.37
N$53
  Bottom 0.203: P8-12.18 94.7,26.1 94.1,25.5 84.3,25.5 82.5,27.3 78.2,27.3 77.2,26.3 76.2,26.3 74.3,24.4 U$2.39
N$54
  Bottom 0.203: P8-12.19 94.7,23.6 85,23.6 82.3,26.3 78.4,26.3 76.8,24.7 U$2.41
N$55
  Top 0.203: P8-12.20 94.7,21.1 85.1,21.1 82.2,24 80.2,24 79.4,24.8 U$2.43
N$56
  Bottom 0.203: P8-12.21 94.7,18.5 93.9,17.7 88.1,17.7 83.7,22.1 83.7,23.1 81.9,24.9 81.9,25.1 U$2.45
N$58
  Bottom 0.203: P8-21.2 97.7,76.9 97.7,74.8 93.4,70.5 93.4,68.6 92.9,68.1 92.9,67.7 92.4,67.2 92.4,66.2 91.9,65.7 91.9,65.3 91.4,64.8 91.4,63.9 90.9,63.4 90.9,63 90.4,62.5 90.4,61.5 89.9,61 89.9,60.7 89.4,60.2 89.4,59.2 88.9,58.7 88.9,58.3 88.4,57.8 88.4,56.9 87.9,56.4 87.9,56 87.4,55.5 87.4,54.5 86.9,54 86.9,53.6 86.4,53.1 86.4,52.2 85.9,51.7 85.9,51.3 85.4,50.8 85.4,49.8 84.9,49.3 84.9,49 84.4,48.5 84.4,47.5 83.9,47 83.9,46.6 83.4,46.1 83.4,45.2 83,44.8 74.7,44.8 73.7,43.8 72.7,43.8 71.5,42.6 70.4,42.6 69.2,41.4 68.1,41.4 66.8,40.1 65.7,40.1 64.5,38.9 63.4,38.9 62.2,37.7 61.1,37.7 59.9,36.5 58.8,36.5 57.6,35.3 56.5,35.3 55.2,34 54.1,34 52.9,32.8 51.7,32.8 50.5,31.6 49.4,31.6 48.2,30.4 47.1,30.4 45.9,29.2 44.8,29.2 43.5,27.9 42.4,27.9 41.2,26.7 40,26.7 38.8,25.5 37.8,25.5 36.6,24.3 35.5,24.3 34.2,23 33.1,23 31.9,21.8 30.8,21.8 29.9,20.9 29.9,18.9 29,18 U$2.4
N$59
  Bottom 0.203: P8-22.1 97.2,69.3 96.3,69.3 95.1,68.1 94.5,68.1 93.4,67 93.4,66 92.9,65.5 92.9,65.1 92.4,64.6 92.4,63.7 91.9,63.2 91.9,62.8 91.4,62.3 91.4,61.3 90.9,60.8 90.9,60.5 90.4,60 90.4,59 89.9,58.5 89.9,58.1 89.4,57.6 89.4,56.7 88.9,56.2 88.9,55.8 88.4,55.3 88.4,54.3 87.9,53.8 87.9,53.4 87.4,52.9 87.4,52 86.9,51.5 86.9,51.1 86.4,50.6 86.4,49.6 85.9,49.1 85.9,48.8 85.4,48.3 85.4,47.3 84.9,46.8 84.9,46.4 84.4,45.9 84.4,45 83.2,43.8 74.9,43.8 73.9,42.8 72.9,42.8 71.7,41.6 70.6,41.6 69.4,40.4 68.3,40.4 67,39.1 65.9,39.1 64.7,37.9 63.6,37.9 62.4,36.7 61.3,36.7 60.1,35.5 59,35.5 57.8,34.3 56.7,34.3 55.4,33 54.3,33 53.1,31.8 51.9,31.8 50.7,30.6 49.6,30.6 48.4,29.4 47.3,29.4 46.1,28.2 45,28.2 43.7,26.9 42.6,26.9 41.4,25.7 40.2,25.7 39,24.5 38,24.5 36.8,23.3 35.7,23.3 34.4,22 33.3,22 32.4,21.1 32.4,19.1 31.5,18.2 U$2.6
N$60
  Bottom 0.203: P8-22.2 97.2,66.7 96.2,66.7 95,65.5 94.5,65.5 93.4,64.4 93.4,63.5 92.9,63 92.9,62.6 92.4,62.1 92.4,61.1 91.9,60.6 91.9,60.3 91.4,59.8 91.4,58.8 90.9,58.3 90.9,57.9 90.4,57.4 90.4,56.5 89.9,56 89.9,55.6 89.4,55.1 89.4,54.1 88.9,53.6 88.9,53.2 88.4,52.7 88.4,51.8 87.9,51.3 87.9,50.9 87.4,50.4 87.4,49.4 86.9,48.9 86.9,48.6 86.4,48.1 86.4,47.1 85.9,46.6 85.9,46.2 85.4,45.7 85.4,44.8 83.4,42.8 75.1,42.8 74.1,41.8 73.1,41.8 71.9,40.6 70.8,40.6 69.6,39.4 68.5,39.4 67.2,38.1 66.1,38.1 64.9,36.9 63.8,36.9 62.6,35.7 61.5,35.7 60.3,34.5 59.2,34.5 58,33.3 56.9,33.3 55.6,32 54.5,32 53.3,30.8 52.1,30.8 50.9,29.6 49.8,29.6 48.6,28.4 47.5,28.4 46.3,27.2 45.2,27.2 43.9,25.9 42.8,25.9 41.6,24.7 40.4,24.7 39.2,23.5 38.2,23.5 37,22.3 35.9,22.3 34.9,21.3 34.9,19.3 34,18.4 U$2.8
N$61
  Bottom 0.203: P8-22.3 97.2,64.2 96.3,64.2 95.1,63 94.5,63 93.4,61.9 93.4,60.9 92.9,60.4 92.9,60.1 92.4,59.6 92.4,58.6 91.9,58.1 91.9,57.7 91.4,57.2 91.4,56.3 90.9,55.8 90.9,55.4 90.4,54.9 90.4,53.9 89.9,53.4 89.9,53 89.4,52.5 89.4,51.6 88.9,51.1 88.9,50.7 88.4,50.2 88.4,49.2 87.9,48.7 87.9,48.4 87.4,47.9 87.4,46.9 86.9,46.4 86.9,46 86.4,45.5 86.4,44.6 83.6,41.8 75.3,41.8 74.3,40.8 73.3,40.8 72.1,39.6 71,39.6 69.8,38.4 68.7,38.4 67.4,37.1 66.3,37.1 65.1,35.9 64,35.9 62.8,34.7 61.7,34.7 60.5,33.5 59.4,33.5 58.2,32.3 57.1,32.3 55.8,31 54.7,31 53.5,29.8 52.3,29.8 51.1,28.6 50,28.6 48.8,27.4 47.7,27.4 46.5,26.2 45.4,26.2 44.1,24.9 43,24.9 41.8,23.7 40.6,23.7 39.4,22.5 38.4,22.5 37.4,21.5 37.4,19.4 36.6,18.6 U$2.10
N$62
  Bottom 0.203: P8-22.4 97.2,61.6 96.2,61.6 95.1,60.5 94.5,60.5 93.4,59.4 93.4,58.4 92.9,57.9 92.9,57.5 92.4,57 92.4,56.1 91.9,55.6 91.9,55.2 91.4,54.7 91.4,53.7 90.9,53.2 90.9,52.8 90.4,52.3 90.4,51.4 89.9,50.9 89.9,50.5 89.4,50 89.4,49 88.9,48.5 88.9,48.2 88.4,47.7 88.4,46.7 87.9,46.2 87.9,45.8 87.4,45.3 87.4,44.4 83.8,40.8 75.5,40.8 74.5,39.8 73.5,39.8 72.3,38.6 71.2,38.6 70,37.4 68.9,37.4 67.6,36.1 66.5,36.1 65.3,34.9 64.2,34.9 63,33.7 61.9,33.7 60.7,32.5 59.6,32.5 58.4,31.3 57.3,31.3 56,30 54.9,30 53.7,28.8 52.5,28.8 51.3,27.6 50.2,27.6 49,26.4 47.9,26.4 46.7,25.2 45.6,25.2 44.3,23.9 43.2,23.9 42,22.7 40.9,22.7 40.2,21.9 40,19.8 39.1,18.9 U$2.12
N$63
  Bottom 0.203: P8-22.5 97.2,59.1 96.3,59.1 95.1,57.9 94.5,57.9 93.4,56.8 93.4,55.9 92.9,55.4 92.9,55 92.4,54.5 92.4,53.5 91.9,53 91.9,52.6 91.4,52.1 91.4,51.2 90.9,50.7 90.9,50.3 90.4,49.8 90.4,48.8 89.9,48.3 89.9,48 89.4,47.5 89.4,46.5 88.9,46 88.9,45.6 88.4,45.1 88.4,44.2 84,39.8 75.7,39.8 74.7,38.8 73.7,38.8 72.5,37.6 71.4,37.6 70.2,36.4 69.1,36.4 67.8,35.1 66.7,35.1 65.5,33.9 64.4,33.9 63.2,32.7 62.1,32.7 60.9,31.5 59.8,31.5 58.6,30.3 57.5,30.3 56.2,29 55.1,29 53.9,27.8 52.7,27.8 51.5,26.6 50.4,26.6 49.2,25.4 48.1,25.4 46.9,24.2 45.8,24.2 44.5,22.9 43.4,22.9 42.5,22 42.5,20 41.6,19.1 U$2.14
N$64
  Bottom 0.203: P8-22.6 97.2,56.6 96.3,56.6 95.1,55.4 94.5,55.4 93.4,54.3 93.4,53.3 92.9,52.8 92.9,52.4 92.4,51.9 92.4,51 91.9,50.5 91.9,50.1 91.4,49.6 91.4,48.6 90.9,48.1 90.9,47.8 90.4,47.3 90.4,46.3 89.9,45.8 89.9,45.4 89.4,44.9 89.4,44 84.2,38.8 75.9,38.8 74.9,37.8 73.9,37.8 72.7,36.6 71.6,36.6 70.4,35.4 69.3,35.4 68,34.1 66.9,34.1 65.7,32.9 64.6,32.9 63.4,31.7 62.3,31.7 61.1,30.5 60,30.5 58.8,29.3 57.7,29.3 56.4,28 55.3,28 54.1,26.8 52.9,26.8 51.7,25.6 50.6,25.6 49.4,24.4 48.3,24.4 47.1,23.2 46,23.2 45,22.2 45,20.1 44.2,19.3 U$2.16
N$65
  Bottom 0.203: P8-22.7 97.2,54 96.2,54 95,52.8 94.5,52.8 93.4,51.7 93.4,50.8 92.9,50.3 92.9,49.9 92.4,49.4 92.4,48.4 91.9,47.9 91.9,47.6 91.4,47.1 91.4,46.1 90.9,45.6 90.9,45.2 90.4,44.7 90.4,43.8 84.4,37.8 76.1,37.8 75.1,36.8 74.1,36.8 72.9,35.6 71.8,35.6 70.6,34.4 69.5,34.4 68.2,33.1 67.1,33.1 65.9,31.9 64.8,31.9 63.6,30.7 62.5,30.7 61.3,29.5 60.2,29.5 59,28.3 57.9,28.3 56.6,27 55.5,27 54.3,25.8 53.1,25.8 51.9,24.6 50.8,24.6 49.6,23.4 48.5,23.4 47.6,22.5 47.6,20.4 46.7,19.5 U$2.18
N$66
  Bottom 0.203: U$2.20 49.2,19.8 50.1,20.7 50.1,22.7 51,23.6 52.1,23.6 53.3,24.8 54.5,24.8 55.7,26 56.8,26 58.1,27.3 59.2,27.3 60.4,28.5 61.5,28.5 62.7,29.7 63.8,29.7 65,30.9 66.1,30.9 67.3,32.1 68.4,32.1 69.7,33.4 70.8,33.4 72,34.6 73.1,34.6 74.3,35.8 75.3,35.8 76.3,36.8 84.4,36.8 85.9,35.3 87.2,35.3 88.4,36.5 88.4,37.5 88.9,38 88.9,38.4 89.4,38.9 89.4,39.8 89.9,40.3 89.9,40.7 90.4,41.2 90.4,42.2 90.9,42.7 90.9,43.1 91.4,43.6 91.4,44.5 91.9,45 91.9,45.4 92.4,45.9 92.4,46.9 92.9,47.4 92.9,47.7 93.4,48.2 93.4,49.2 94.5,50.3 95.1,50.3 96.3,51.5 97.2,51.5 P8-22.8
N$67
  Bottom 0.203: U$2.22 51.8,20 52.6,20.8 52.6,22.9 53.5,23.8 54.7,23.8 55.9,25 57,25 58.3,26.3 59.4,26.3 60.6,27.5 61.7,27.5 62.9,28.7 64,28.7 65.2,29.9 66.3,29.9 67.5,31.1 68.6,31.1 69.9,32.4 71,32.4 72.2,33.6 73.3,33.6 74.5,34.8 75.5,34.8 76.5,35.8 84.2,35.8 86,34 87.8,34 88.4,34.6 88.4,35 88.9,35.5 88.9,35.8 89.4,36.3 89.4,37.3 89.9,37.8 89.9,38.2 90.4,38.7 90.4,39.6 90.9,40.1 90.9,40.5 91.4,41 91.4,42 91.9,42.5 91.9,42.9 92.4,43.4 92.4,44.3 92.9,44.8 92.9,45.2 93.4,45.7 93.4,46.7 94.5,47.8 95.1,47.8 96.2,48.9 97.2,48.9 P8-22.9
N$68
  Bottom 0.203: U$2.24 54.3,20.2 55.2,21.1 55.2,23.1 56.1,24 57.2,24 58.5,25.3 59.6,25.3 60.8,26.5 61.9,26.5 63.1,27.7 64.2,27.7 65.4,28.9 66.5,28.9 67.7,30.1 68.8,30.1 70.1,31.4 71.2,31.4 72.4,32.6 73.5,32.6 74.7,33.8 75.7,33.8 76.7,34.8 84,34.8 85.8,33 88.6,33 89.4,33.8 89.4,34.8 89.9,35.3 89.9,35.6 90.4,36.1 90.4,37.1 90.9,37.6 90.9,38 91.4,38.5 91.4,39.4 91.9,39.9 91.9,40.3 92.4,40.8 92.4,41.8 92.9,42.3 92.9,42.7 93.4,43.2 93.4,44.1 94.5,45.2 95.1,45.2 96.3,46.4 97.2,46.4 P8-22.10
N$69
  Bottom 0.203: U$2.26 56.8,20.4 57.7,21.3 57.7,23.3 58.7,24.3 59.8,24.3 61,25.5 62.1,25.5 63.3,26.7 64.4,26.7 65.6,27.9 66.7,27.9 67.9,29.1 69,29.1 70.3,30.4 71.4,30.4 72.6,31.6 73.7,31.6 74.9,32.8 75.9,32.8 76.9,33.8 83.8,33.8 85.6,32 89.2,32 89.9,32.7 89.9,33.1 90.4,33.6 90.4,34.6 90.9,35.1 90.9,35.4 91.4,35.9 91.4,36.9 91.9,37.4 91.9,37.8 92.4,38.3 92.4,39.2 92.9,39.7 92.9,40.1 93.4,40.6 93.4,41.6 94.5,42.7 95.1,42.7 96.3,43.9 97.2,43.9 P8-22.11
N$70
  Bottom 0.203: P8-22.12 97.2,41.3 96.2,41.3 95,40.1 94.5,40.1 93.4,39 93.4,38.1 92.9,37.6 92.9,37.2 92.4,36.7 92.4,35.7 91.9,35.2 91.9,34.9 91.4,34.4 91.4,33.4 90.9,32.9 90.9,32.5 90.4,32 90.4,31.1 90.3,31 85.4,31 83.6,32.8 77.1,32.8 76.1,31.8 75.1,31.8 73.9,30.6 72.8,30.6 71.6,29.4 70.5,29.4 69.2,28.1 68.1,28.1 66.9,26.9 65.8,26.9 64.6,25.7 63.5,25.7 62.3,24.5 61.2,24.5 60.2,23.5 60.2,21.5 U$2.28
N$71
  Bottom 0.203: P8-22.13 97.2,38.8 96.3,38.8 95.1,37.6 94.5,37.6 93.4,36.5 93.4,35.5 92.9,35 92.9,34.7 92.4,34.2 92.4,33.2 91.9,32.7 91.9,32.3 91.4,31.8 91.4,30.9 90.5,30 85.2,30 83.4,31.8 77.3,31.8 76.3,30.8 75.3,30.8 74.1,29.6 73,29.6 71.8,28.4 70.7,28.4 69.4,27.1 68.3,27.1 67.1,25.9 66,25.9 64.8,24.7 63.7,24.7 62.7,23.7 62.7,21.7 61.9,20.9 U$2.30
N$72
  Bottom 0.203: P8-22.14 97.2,36.2 96.2,36.2 95.1,35.1 94.5,35.1 93.4,34 93.4,33 92.9,32.5 92.9,32.1 92.4,31.6 92.4,30.7 91.9,30.2 91.9,29.8 91.1,29 85,29 83.2,30.8 77.5,30.8 76.5,29.8 75.5,29.8 74.3,28.6 73.2,28.6 72,27.4 70.9,27.4 69.6,26.1 68.5,26.1 67.3,24.9 66.2,24.9 65.3,24 65.3,22 64.4,21.1 U$2.32
N$73
  Bottom 0.203: P8-22.15 97.2,33.7 96.3,33.7 95.1,32.5 94.5,32.5 93.4,31.4 93.4,30.5 92.9,30 92.9,29.6 92.4,29.1 92.4,28.1 92.3,28 84.8,28 83,29.8 77.7,29.8 76.7,28.8 75.7,28.8 74.5,27.6 73.4,27.6 72.2,26.4 71.1,26.4 69.8,25.1 68.7,25.1 67.8,24.2 67.8,22.2 66.9,21.3 U$2.34
N$74
  Bottom 0.203: P8-22.16 97.2,31.2 96.3,31.2 95.1,30 94.5,30 93.4,28.9 93.4,27.9 92.5,27 84.6,27 82.8,28.8 77.9,28.8 76.9,27.8 75.9,27.8 74.7,26.6 73.6,26.6 72.4,25.4 71.3,25.4 70.3,24.4 70.3,22.3 69.5,21.5 U$2.36
N$75
  Bottom 0.203: P8-22.17 97.2,28.6 96.2,28.6 95,27.4 94.5,27.4 93.1,26 84.4,26 82.6,27.8 78.1,27.8 77.1,26.8 76.1,26.8 74.9,25.6 73.8,25.6 72.9,24.7 72.9,22.6 72,21.7 U$2.38
N$76
  Bottom 0.203: P8-22.18 97.2,26.1 96.3,26.1 95.2,25 84.2,25 82.4,26.8 78.3,26.8 77.3,25.8 76.3,25.8 75.4,24.9 75.4,22.9 74.5,22 U$2.40
N$77
  Top 0.508: Q1.3 16.7,67.1 16.6,67.2 16.6,67.8 16.5,67.9 16.5,69.3 DF.A 16.5,69.5 16.5,70.7 16.4,70.8 16.4,73.8 14.3,75.9 14.3,80.6 RELAY.9
N$78
  Bottom 0.203: P8-22.19 97.3,23.5 99.6,21.2 99.6,18.3 97.5,16.2 87.8,16.2 83.9,20.1 79.1,20.1 77.1,22.1 U$2.42
N$79
  Bottom 0.203: P8-22.20 97.2,21 95.9,19.7 95.9,18.1 95,17.2 88,17.2 83.2,22 83.2,23 82.5,23.7 80.9,23.7 79.6,22.4 U$2.44
N$80
  Bottom 0.203: U$2.46 82.1,22.5 87.9,16.7 96.7,16.7 96.7,16.8 97.2,17.3 97.2,18.5 P8-22.21
N$89
  Bottom 0.203: P9-1.9 48.2,80.7 48.2,79.7 47,78.5 47,74.8 42.3,70.1 U$2.63
N$91
  Bottom 0.203: P9-1.11 53.3,80.7 53.3,79.7 51.9,78.3 51.9,77.7 51.3,77.1 50.3,77.1 49.6,76.4 49.2,76.4 49,76.2 49,74.4 47.2,72.6 47.2,70.6 U$2.67
N$92
  Bottom 0.203: P9-1.12 55.8,80.7 55.8,79.7 54.7,78.6 54.7,75.6 49.9,70.8 U$2.69
N$93
  Bottom 0.203: P9-1.13 58.4,80.7 58.4,79.7 57.2,78.5 57.2,78 55.7,76.5 55.7,75.4 52.3,72 52.3,71 U$2.71
N$94
  Bottom 0.203: P9-1.14 60.9,80.7 60.9,79.7 59.7,78.5 59.7,77 59.6,76.9 57.7,76.9 57.2,76.4 56.8,76.4 56.7,76.3 56.7,75.2 54.8,73.3 54.8,71.2 U$2.73
N$95
  Bottom 0.203: P9-1.15 63.5,79.8 62.3,78.6 62.3,76.3 57.5,71.5 U$2.75
N$96
  Bottom 0.203: P9-1.16 66,80.7 66,79.7 64.8,78.5 64.8,77 63.7,75.9 63.1,75.9 59.9,72.7 59.9,71.7 U$2.77
N$97
  Bottom 0.203: P9-1.17 68.5,80.7 68.5,79.7 67.4,78.6 67.4,78 66,76.6 65.6,76.6 63.9,74.9 63.3,74.9 62.4,74 62.4,71.9 U$2.79
N$98
  Bottom 0.203: P9-1.18 71.1,80.7 71.1,79.7 69.9,78.5 69.9,77 65,72.1 U$2.81
N$99
  Bottom 0.203: P9-1.19 73.6,80.7 73.6,79.7 72.4,78.5 72.4,77 72,76.6 70.7,76.6 67.5,73.4 67.5,72.4 U$2.83
N$100
  Bottom 0.203: P9-1.20 76.2,79.8 75,78.6 75,78 73.6,76.6 73.2,76.6 72.2,75.6 70.9,75.6 70,74.7 70,72.6 U$2.85
N$101
  Bottom 0.203: P9-1.21 78.7,80.7 78.7,79.7 77.5,78.5 77.5,77 73.3,72.8 72.6,72.8 U$2.87
N$102
  Top 0.203: P9-1.22 81.2,80.7 81.2,79.7 79.9,78.4 79.9,77.8 75.1,73 U$2.89
N$103
  Top 0.203: P9-1.23 83.8,80.7 83.8,79.7 82.4,78.3 82.4,77.8 81.5,76.9 80.5,76.9 80,76.4 79.7,76.4 77.6,74.3 77.6,73.2 U$2.91
N$112
  Bottom 0.203: P9-2.9 48.2,78.2 47.5,77.5 47.5,74.7 43.4,70.6 43.4,68.5 42.5,67.6 U$2.64
N$114
  Bottom 0.203: P9-2.11 53,78.2 51.4,76.6 50.4,76.6 49.5,75.7 49.5,74.3 47.7,72.5 47.7,71.7 48.4,71 48.4,68.9 47.6,68.1 U$2.68
N$115
  Bottom 0.203: P9-2.12 55.8,78.2 55.2,77.6 55.2,75.5 51,71.3 51,69.2 50.1,68.3 U$2.70
N$116
  Bottom 0.203: P9-2.13 58.4,78.2 57.1,76.9 56.7,76.9 56.2,76.4 56.2,75.3 53.5,72.6 53.5,69.4 52.6,68.5 U$2.72
N$117
  Bottom 0.203: P9-2.14 60.9,78.2 60.2,77.5 60.2,76.9 59.7,76.4 57.8,76.4 57.2,75.8 57.2,75.1 55.3,73.2 55.3,72.4 56,71.7 56,69.6 55.1,68.7 U$2.74
N$118
  Bottom 0.203: P9-2.15 62.8,77.5 62.8,76.2 58.5,71.9 58.5,69.7 57.7,68.9 U$2.76
N$119
  Bottom 0.203: P9-2.16 66,78.2 65.3,77.5 65.3,76.9 63.8,75.4 63.2,75.4 61.1,73.3 61.1,70.1 60.2,69.2 U$2.78
N$120
  Bottom 0.203: P9-2.17 68.5,78.2 67.2,76.9 66.9,76.9 66.1,76.1 65.7,76.1 63.6,74 63.6,70.3 62.7,69.4 U$2.80
N$121
  Bottom 0.203: P9-2.18 71.1,78.2 70.4,77.5 70.4,76.9 66.1,72.6 66.1,70.4 65.3,69.6 U$2.82
N$122
  Bottom 0.203: P9-2.19 73.6,78.2 72.9,77.5 72.9,76.9 72.1,76.1 70.8,76.1 68.7,74 68.7,70.7 67.8,69.8 U$2.84
N$123
  Bottom 0.203: P9-2.20 74.9,76.9 74.5,76.9 73.7,76.1 73.3,76.1 71.2,74 71.2,70.9 70.3,70 U$2.86
N$124
  Bottom 0.203: P9-2.21 78.7,78.2 78,77.5 78,76.9 76.3,75.2 76.3,72.6 75.2,71.5 74.1,71.5 72.9,70.3 U$2.88
N$125
  Top 0.203: P9-2.22 81.2,78.2 79.9,76.9 79.6,76.9 76.3,73.6 76.3,71.4 75.4,70.5 U$2.90
N$126
  Top 0.203: P9-2.23 83.8,78.2 82.5,76.9 82.1,76.9 81.6,76.4 80.6,76.4 80.1,75.9 79.8,75.9 78.8,74.9 78.8,71.6 77.9,70.7 U$2.92
NC
  Top 0.508: RELAY.1 11.7,74.8 JNC.1
NO
  Top 0.508: RELAY.10 8.4,80.6 7.5,79.7 4.2,79.7 JNO.1
PWR_BUT
  Bottom 0.203: P9-1.5 38.1,79.8 36.9,78.6 36.9,78 35.8,76.9 35.1,76.9 34.4,76.2 34.4,75.6 32,73.2 32,69.3 U$2.55
QH*  (via drill 0.3)
  Top 0.203: v83.1,24.6 83.1,32.5 68.7,46.9 68.7,48.7 67.1,50.3 67.1,53.5 74HC595.9 | v88,18.7 88,12.3 89.8,10.5 89.8,8.5 91.1,7.2 EXTOUT1.7
  Bottom 0.203: v83.1,24.6 83.1,24.3 84.2,23.2 84.2,22.2 87.7,18.7 v88,18.7
RL  (via drill 0.3)
  Top 0.203: v33.1,60.5 20.4,60.5 20.3,60.4 RB.1
  Bottom 0.203: P9-2.8 45.7,78.2 44.8,77.3 44.8,75.5 40.8,71.5 40.8,68.2 40,67.4 U$2.62 39.9,67.3 v33.1,60.5
RS  (via drill 0.3)
  Top 0.203: v99.4,79.5 99.6,79.3 99.6,8 97,5.4 RP.1
  Top 0.508: RP.1 97,2.7 96.9,2.6 93.1,2.6 93,2.7 RR.2
  Bottom 0.203: U$2.61 39.6,69.9 39.6,70.9 44.3,75.6 44.3,78.3 45.7,79.7 45.7,80.7 P9-1.8 45.8,80.8 48.1,83.1 89.2,83.1 91.7,80.6 98.3,80.6 v99.4,79.5
SA1  (via drill 0.3)
  Top 0.203: ROE.1 RN.1 62.1,56.8 62.1,53.6 74HC595.13 62.1,53.5 62.1,52.2 62.2,52.1 v62.2,52 | v72.3,45.4 72.3,45.1 84.6,32.8 84.6,25.2 v88,21.8 | v89.4,20.4 89.4,19.7 90.3,18.8 90.3,15.7 91.1,14.9 EXTOUT1.1
  Bottom 0.203: 62.2,52.2 62.2,52.8 | 62.2,52.2 68.6,45.8 69.2,45.8 69.4,45.6 70.6,45.6 70.8,45.4 v72.3,45.4 | v89.4,20.4 v88,21.8 | v62.2,52 62.2,52.2
SCL
  Top 0.203: U$2.65 44.7,70.3 44.7,69.1 43.8,68.2 43.8,67.4 44.6,66.6 45.5,66.6 46.2,65.9 68.8,65.9 72.9,61.8 72.9,61.3 72.8,61.2 72.8,59.9 DS1307.6
  Bottom 0.203: P9-1.10 50.8,79.8 49.4,78.4 49.4,77.8 48,76.4 48,74.6 45.4,72 45.4,71 44.8,70.4 U$2.65
SD5
  Top 0.203: RD.1 58.9,56.9 59,56.8 59,56.5 60.8,54.7 60.8,53.6 74HC595.14
SD6  (via drill 0.3)
  Top 0.203: RC.1 66.1,56.9 66,56.8 66,56.1 64.6,54.7 64.6,53.6 74HC595.11 64.6,53.5 64.6,52.2 64.7,52.1 v64.7,52 | v69.7,46.8 69.7,46.5 83.6,32.6 83.6,25 84.9,23.7 v84.9,22.4 | v88.9,18.7 88.9,12 91.1,9.8 EXTOUT1.5
  Bottom 0.203: v69.7,46.8 68.8,46.8 64.7,50.9 v64.7,52 64.7,52.6 | v84.9,22.4 84.9,22.1 87.6,19.4 88.2,19.4 v88.9,18.7
SD7  (via drill 0.3)
  Top 0.203: RL.1 63.9,56.9 63.8,56.8 63.8,55.9 63.3,55.4 63.3,53.6 74HC595.12 63.3,53.5 63.3,52.2 v63.5,52 | v71,46.1 71,45.8 84.1,32.7 84.1,25.1 85.4,23.8 85.4,22.8 v85.8,22.4 | v88.6,19.9 89.8,18.7 89.8,13.6 91.1,12.3 EXTOUT1.3
  Bottom 0.203: v71,46.1 69.5,46.1 69.3,46.3 68.7,46.3 63.5,51.5 v63.5,52 63.5,52.4 | v85.8,22.4 85.8,21.8 87.7,19.9 v88.6,19.9
SDA
  Top 0.203: DS1307.5 74.1,59.9 74.1,61.2 72.2,63.1 72.2,66.4 46.3,66.4 45,67.7 U$2.66
  Bottom 0.203: P9-2.10 49.5,76.9 49.1,76.9 48.5,76.3 48.5,74.5 45.9,71.9 45.9,68.7 45,67.8 U$2.66
SYS_5V
  Top 0.508: P9-1.4 P9-2.4
  Bottom 0.508: U$2.54 29.7,66.5 29.7,68.8 29.6,68.9 U$2.53 29.57,71.57 33.8,75.8 33.8,76.44 P9-2.4
SYS_RESET
  Bottom 0.203: P9-2.5 36.8,76.9 36.4,76.9 35.9,76.4 35.2,76.4 34.9,76.1 34.9,75.5 32.5,73.1 32.5,70.4 33.2,69.7 33.2,67.5 32.4,66.7 U$2.56
VCC  (via drill 0.3)
  Top 0.203: 57.1,54 C3.1 56.9,54.02 56.9,57.47 | 57.1,54 57.6,54 57.7,54.1 58.3,54.1 58.3,53.6 74HC595.16 | 56.9,57.47 57.3,57.88 59.13,57.88 60.15,58.9 ROE.2 | 57.1,54 57.1,54.02 59.74,51.38 65.02,51.38 65.84,52.19 65.84,53.41 74HC595.10 66.04,53.61 66.04,54.43 66.65,55.03 67.46,55.03 v69.29,53.21 | v75.39,47.11 84.73,37.76 94.89,37.76 95.91,36.75 95.91,10.33 93.88,8.3 93.88,7.28 EXTOUT1.8 | 56.9,57.47 53.24,61.13 30.68,61.13 25.81,66.01 24.79,66.01 U$2.50
  Top 0.508: P9-1.2 P9-2.2 30.4,78 30.4,76 24.5,70.1 24.5,68.6 U$2.49 | RP.2 95,5.8 93.7,7.1 EXTOUT1.8
  Bottom 0.203: v69.29,53.21 v75.39,47.11
  Bottom 0.508: U$2.50 24.7,66.1 24.7,68.4 24.6,68.5 U$2.49
VIN  (via drill 0.3)
  Top 0.305: 68.89,60.52 69.29,60.52 69.5,60.65 | v96.93,15.41 96.93,16.43 98.55,18.05 98.55,57.07 97.74,57.88 71.93,57.88 71.53,58.29 71.12,58.29 68.89,60.52 | 68.89,60.52 v68.68,60.52
  Top 0.508: DF.C 12.5,69.3 12.5,70.9 14.2,72.6 14.2,72.9 RELAY.2 | P9-1.3 P9-2.3 | v75.8,19.4 D3.C | LED.A v82.7,17.8 | v80.5,9.9 80.5,8.3 80.4,8.2 79,8.2 F2.2 | C4.1 69.5,60.65 DS1307.8
  Bottom 0.305: v68.68,60.52 34.14,60.52 33.33,59.71 32.72,59.71 27.23,65.19 27.23,66.01 U$2.52 | 82.6,13.58 95.1,13.58 v96.93,15.41
  Bottom 0.508: U$2.51 27,68.8 26.1,68.8 23.4,71.5 15.7,71.5 14.3,72.9 RELAY.2 | v75.8,19.4 81.1,19.4 v82.7,17.8 82.6,17.6 82.6,13.58 82.6,12 v80.5,9.9 | U$2.52 27.2,66.3 27.2,68.6 U$2.51 | U$2.51 27.04,70.84 32.2,76 32.2,77.38 P9-2.3
VIN_PRE  (via drill 0.3)
  Top 0.508: v47.9,12.4 LM2596.4 | L1.2 55.4,13.2 57.5,15.3 L1'.2 60.5,15.3 74.2,15.3 77.3,12.2 79,12.2 F2.1 79.2,12.2 80.4,12.2 82.4,10.2 C2.+ 83.9,10.4 84.5,11 C0.1
  Bottom 0.508: v47.9,12.4 59.1,12.4 61,14.3 61,15.4 60.3,15.4 L1'.2

## Text on the board
tNames: CO | 1 | 45 | 1 | NO | 2 | 46 | P9 | NC | 3 | OpenSprinkler Beagle (OSBo) v1.1 | beagle.opensprinkler.com | P8 | 5 | 6 | TVS1-8 | 45 | 46 | S1-8